# EAGLE schematic strain-gauge-amplifier-v2 (EAGLE 6.5.0)
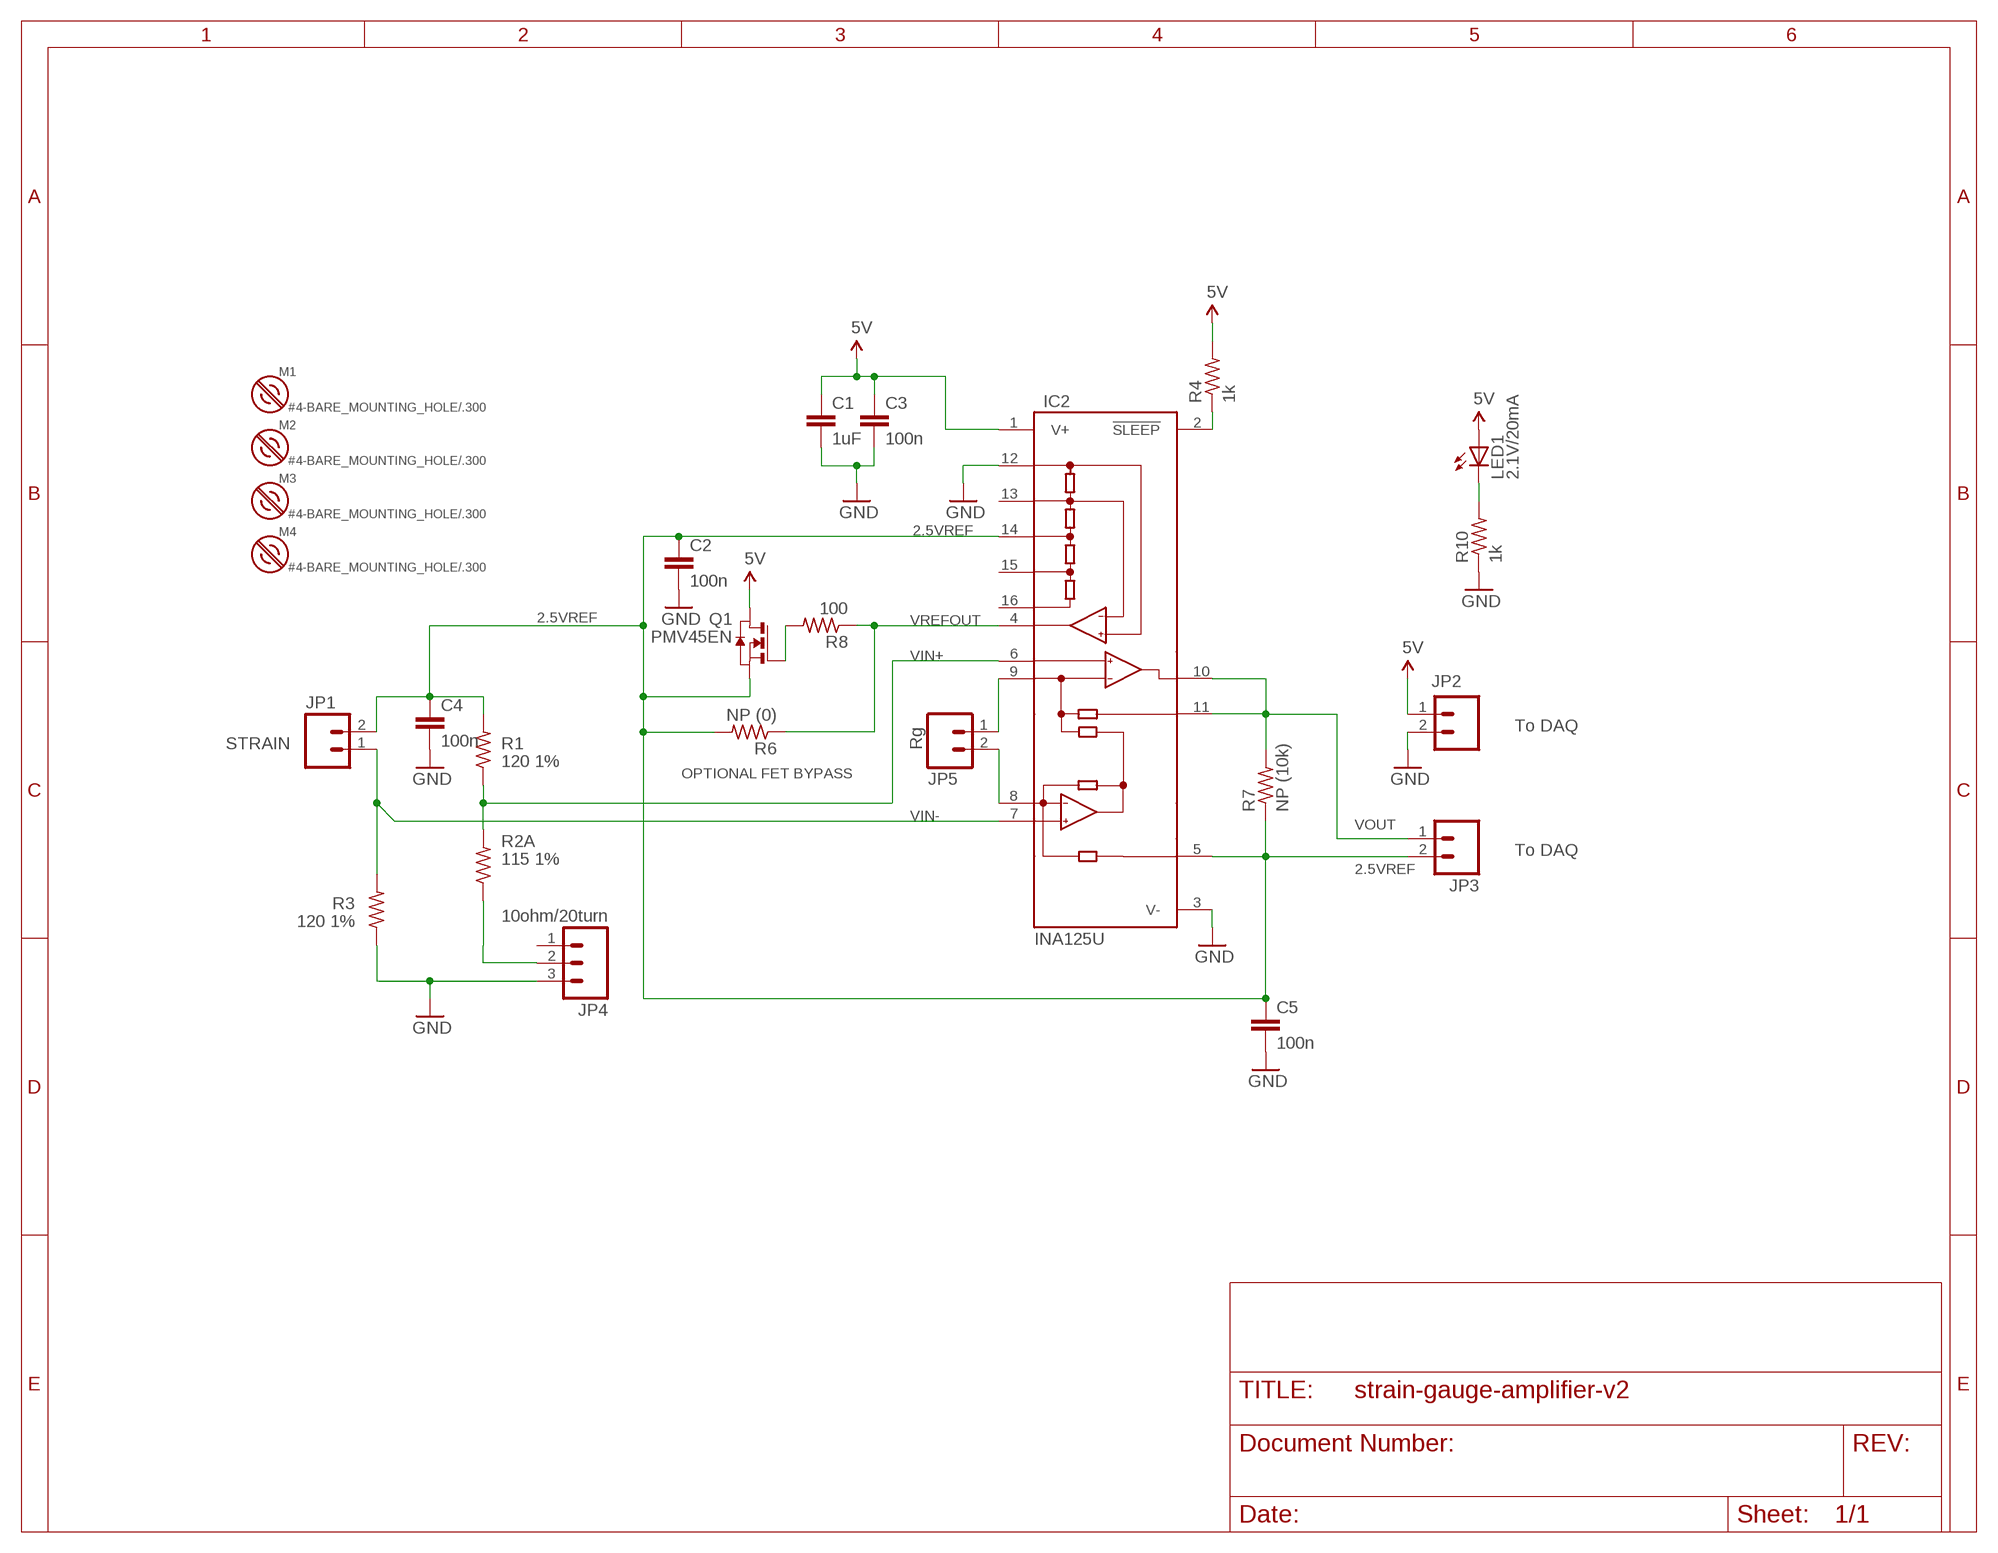
[diagram p0: schematic, sheet 1]

## Parts
C1  1uF  C-EU0805-C-NOSILK  [0805-C-NOSILK]
C2  100n  C-EU0805-C-NOSILK  [0805-C-NOSILK]
C3  100n  C-EU0805-C-NOSILK  [0805-C-NOSILK]
C4  100n  C-EU0805-C-NOSILK  [0805-C-NOSILK]
C5  100n  C-EU0805-C-NOSILK  [0805-C-NOSILK]
IC2  INA125U  [SO16-1]
JP1  STRAIN  M025MM  [SCREWTERMINAL-5MM-2]
JP2  M025MM  [SCREWTERMINAL-5MM-2]
JP3  M025MM  [SCREWTERMINAL-5MM-2]
JP4  10ohm/20turn  M031X03_NO_SILK  [1X03_NO_SILK]
JP5  Rg  M025MM  [SCREWTERMINAL-5MM-2]
LED1  2.1V/20mA  LED0603  [LED-0603]
M1  #4-BARE_MOUNTING_HOLE/.300  [#4/.300-BARE+STD_NUT_OR_STAR_WASHER]
M2  #4-BARE_MOUNTING_HOLE/.300  [#4/.300-BARE+STD_NUT_OR_STAR_WASHER]
M3  #4-BARE_MOUNTING_HOLE/.300  [#4/.300-BARE+STD_NUT_OR_STAR_WASHER]
M4  #4-BARE_MOUNTING_HOLE/.300  [#4/.300-BARE+STD_NUT_OR_STAR_WASHER]
Q1  PMV45EN  [SOT23]
R1  120 1%  R-US_0805-C-NOSILK  [0805-C-NOSILK]
R2A  115 1%  R-US_0805-C-NOSILK  [0805-C-NOSILK]
R3  120 1%  R-US_0805-C-NOSILK  [0805-C-NOSILK]
R4  1k  R-US_0805-C-NOSILK  [0805-C-NOSILK]
R6  NP (0)  R-US_0805-C-NOSILK  [0805-C-NOSILK]
R7  NP (10k)  R-US_0805-C-NOSILK  [0805-C-NOSILK]
R8  100  R-US_0805-C-NOSILK  [0805-C-NOSILK]
R10  1k  R-US_0805-C-NOSILK  [0805-C-NOSILK]

## Nets
2.5VREF: C2.1 C4.1 C5.1 IC2.5(REF) IC2.14(REF2.5) JP1.2 JP3.2 Q1.2(S) R1.2 R6.2 R7.1
5V: C1.1 C3.1 IC2.1(V+) JP2.1 LED1.A Q1.3(D) R4.2
GND: C1.2 C2.2 C3.2 C4.2 C5.2 IC2.3(V-) IC2.12(REFCOM) JP2.2 JP4.3 R3.1 R10.1
N$1: JP4.2 R2A.1
N$3: IC2.9(RG) JP5.1
N$5: IC2.8(RG) JP5.2
N$6: Q1.1(G) R8.2
N$8: IC2.2(!SLEEP) R4.1
N$11: LED1.C R10.2
VIN+: IC2.6(+IN) R1.1 R2A.2
VIN-: IC2.7(-VIN) JP1.1 R3.2
VOUT: IC2.10(OUT) IC2.11(SENSE) JP3.1 R7.2
VREFOUT: IC2.4(REFOUT) R6.1 R8.1
Unconnected: IC2.13(REFBG) IC2.15(REF5) IC2.16(REF10) JP4.1

## Notes on the sheet
- To DAQ
- OPTIONAL FET BYPASS
- To DAQ

## Library data of the parts
C1-C5 = rcl_custom:C-EU: CAPACITOR, European symbol
IC2 = burr-brown:INA125: Instrumentation Amplifier with Precision Voltage Reference; MF: TEXAS INSTRUMENT CONNECTORS; MPN: INA125U; OC_FARNELL: 1304375; OC_NEWARK: 80K5901
JP1-JP3 JP5 = SparkFun-Connectors:M02: Header 2 Standard 2-pin 0.1" header. Use with straight break away headers (SKU : PRT-00116), right angle break away headers (PRT-00553), swiss pins (PRT-00743), machine pins (PRT-00117), and female headers (PRT-00115). Molex polarized connector foot print use with SKU : PRT-08233 with associated crimp pins and housings.
JP4 = SparkFun-Connectors:M03: Header 3 Standard 3-pin 0.1" header. Use with straight break away headers (SKU : PRT-00116), right angle break away headers (PRT-00553), swiss pins (PRT-00743), machine pins (PRT-00117), and female headers (PRT-00115). Molex polarized connector foot print use with SKU : PRT-08232 with associated crimp pins and housings.
LED1 = SparkFun-LED:LED: LEDs Standard schematic elements and footprints for 5mm, 3mm, 1206, and 0603 sized LEDs. 5mm - Spark Fun Electronics SKU : COM-00529 (and others)
M1-M4 = mount:#4-BARE_MOUNTING_HOLE: 1/8" drill hole for #4 screw mount
Q1 = Q_PMV45EN_N_ch_MOSFET:PMV45EN
R1 R2A R3 R4 R6-R8 R10 = rcl_custom:R-US_: RESISTOR, American symbol